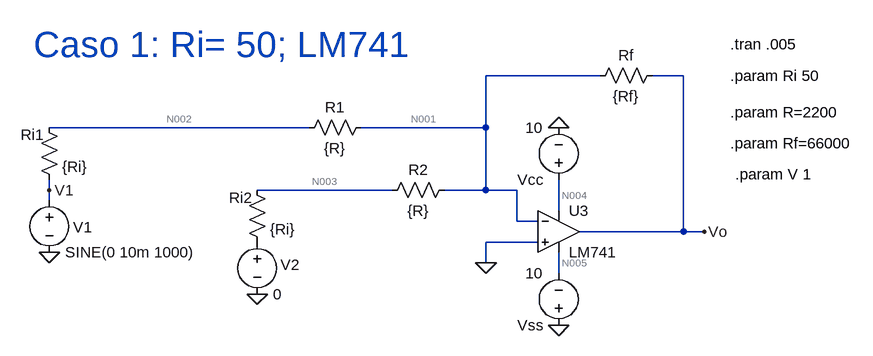
[diagram p0: schematic Caso 1.1 - LM741.asc]
Caso 1.1 - LM741.asc, the LTspice schematic file:
Version 4
SHEET 1 968 1072
WIRE 560 352 384 352
WIRE 688 352 640 352
WIRE 112 432 -288 432
WIRE 384 432 384 352
WIRE 384 432 192 432
WIRE -288 528 -288 512
WIRE 240 528 32 528
WIRE 384 528 384 432
WIRE 384 528 320 528
WIRE 432 528 384 528
WIRE -288 544 -288 528
WIRE 496 560 496 512
WIRE 432 576 432 528
WIRE 464 576 432 576
WIRE 688 592 688 352
WIRE 688 592 528 592
WIRE 720 592 688 592
WIRE 464 608 384 608
WIRE 384 640 384 608
WIRE 496 656 496 624
FLAG -288 624 0
FLAG 32 688 0
FLAG 384 640 0
FLAG 720 592 Vo
FLAG 496 432 0
FLAG 496 736 0
FLAG -288 528 V1
SYMBOL ZZZ\\OpAmp\\LM741 496 528 R0
SYMATTR InstName U3
SYMBOL res 208 416 R90
WINDOW 0 0 56 VBottom 2
WINDOW 3 32 56 VTop 2
SYMATTR InstName R1
SYMATTR Value {R}
SYMBOL res 336 512 R90
WINDOW 0 0 56 VBottom 2
WINDOW 3 32 56 VTop 2
SYMATTR InstName R2
SYMATTR Value {R}
SYMBOL voltage -288 528 R0
WINDOW 0 37 57 Left 2
WINDOW 123 0 0 Left 0
WINDOW 39 0 0 Left 0
SYMATTR InstName V1
SYMATTR Value SINE(0 10m 1000)
SYMBOL voltage 32 592 R0
WINDOW 0 36 51 Left 2
WINDOW 123 0 0 Left 0
WINDOW 39 0 0 Left 0
SYMATTR InstName V2
SYMATTR Value 0
SYMBOL res 656 336 R90
WINDOW 0 0 56 VBottom 2
WINDOW 3 32 56 VTop 2
SYMATTR InstName Rf
SYMATTR Value {Rf}
SYMBOL voltage 496 752 R180
WINDOW 123 0 0 Left 0
WINDOW 39 0 0 Left 0
SYMATTR InstName Vss
SYMATTR Value 10
SYMBOL voltage 496 528 R180
WINDOW 123 0 0 Left 0
WINDOW 39 0 0 Left 0
SYMATTR InstName Vcc
SYMATTR Value 10
SYMBOL res -304 416 R0
WINDOW 0 -28 27 Left 2
SYMATTR InstName Ri1
SYMATTR Value {Ri}
SYMBOL res 16 512 R0
WINDOW 0 -27 28 Left 2
SYMATTR InstName Ri2
SYMATTR Value {Ri}
TEXT 760 304 Left 2 !.tran .005
TEXT 760 352 Left 2 !.param Ri 50
TEXT 760 408 Left 2 !.param R=2200
TEXT 760 456 Left 2 !.param Rf=66000
TEXT 768 504 Left 2 !.param V 1
TEXT -312 304 Left 5 ;Caso 1: Ri= 50; LM741

The netlist it stands for:
* Caso 1.1 - LM741.asc
XU3 0 N001 N004 N005 Vo LM741  ; pins In+ In- V+ V- OUT
R1 N001 N002 {R}
R2 N001 N003 {R}
V1 V1 0 SINE(0 10m 1000)
V2 P001 0 0
Rf Vo N001 {Rf}
Vss 0 N005 10
Vcc N004 0 10
Ri1 N002 V1 {Ri}
Ri2 N003 P001 {Ri}
.tran .005
.param Ri 50
.param R=2200
.param Rf=66000
.param V 1
* Caso 1: Ri= 50; LM741
.lib LM741.lib
.backanno
.end

* Results of the author's LTspice run, read from the files saved beside the schematic
* Operating Point, zero values left out:
*   V(n001) = 999.7 µV
*   V(n005) = -10 V
*   V(n004) = 10 V
*   V(vo) = 66.37 mV
*   V(n002) = 22.22 µV
*   V(n003) = 22.22 µV
*   I(R1) = 444.3 nA
*   I(R2) = 444.3 nA
*   I(Rf) = 990.5 nA
*   I(Ri1) = 444.3 nA
*   I(Ri2) = 444.3 nA
*   I(V1) = 444.3 nA
*   I(V2) = 444.3 nA
*   I(Vss) = -1.576 mA
*   I(Vcc) = -1.577 mA
*   Ix(u3:1) = 57.86 nA
*   Ix(u3:2) = 101.9 nA
*   Ix(u3:99) = 1.577 mA
*   Ix(u3:50) = -1.576 mA
*   Ix(u3:28) = -990.5 nA
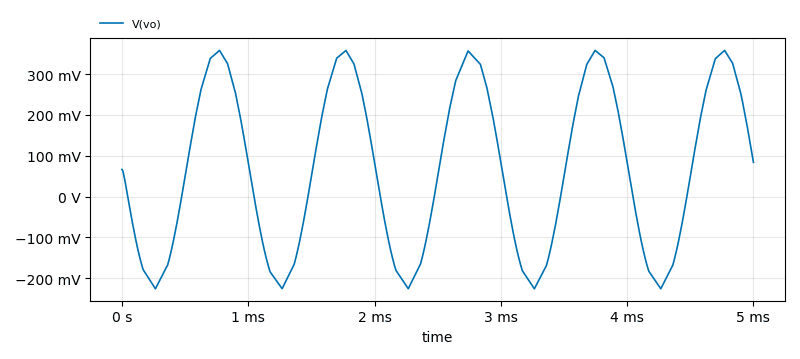
[diagram p1: Transient Analysis of Caso 1.1 - LM741.asc, plotted from the saved traces]
* Transient Analysis, 1 run:
*   V(vo): min -225.9 mV, max 358.1 mV, average 66.62 mV, rms 214.7 mV, last 83.91 mV